# Altium schematic sheet pca20035_sheet4_sensors_and_leds.SchDoc: Thingy:91 Sensors and LEDs
size A3; Organization: Nordic Semiconductor; DocumentNumber: 4; SheetNumber: 4; SheetTotal: 6; CompanyName: Nordic Semiconductor; DocumentSize: A3
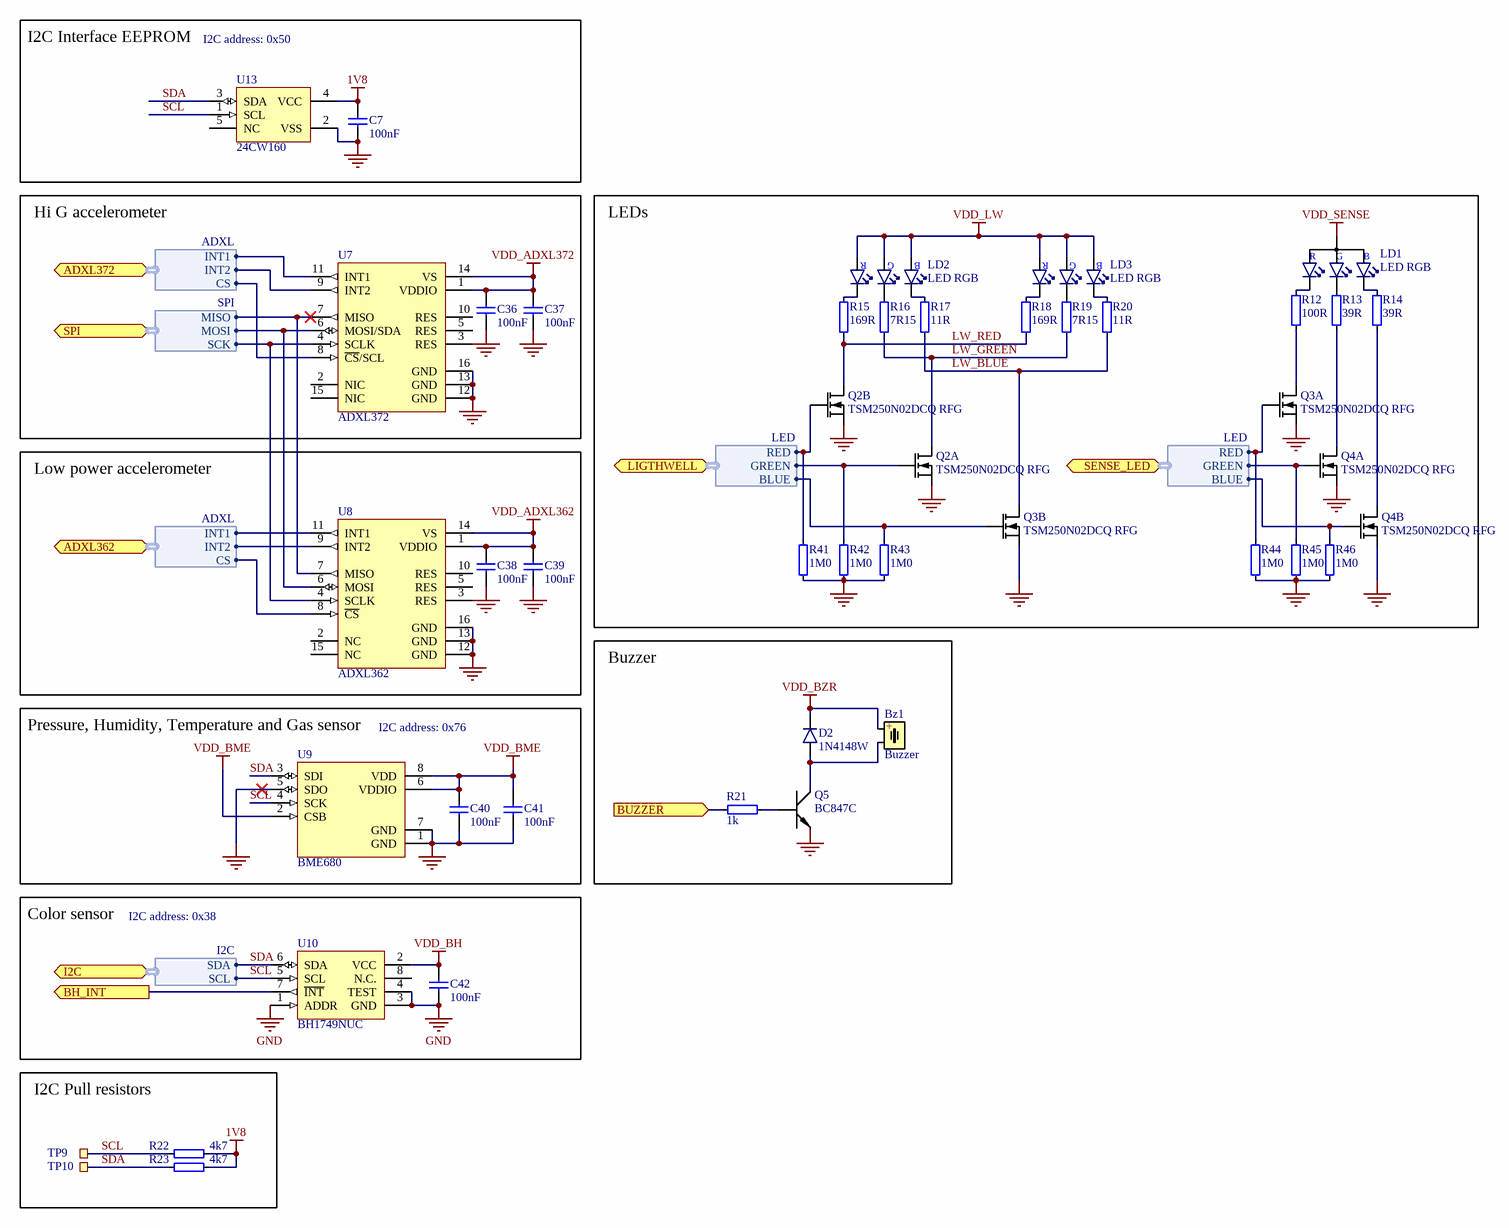
[diagram p0: pca20035_sheet4_sensors_and_leds.SchDoc]

## Parts
Bz1  Buzzer  [Buzzer_SMD_7.5x7.5]
C7  100nF  [CAPC0603X03L_C]
C36  100nF  [CAPC0603X03L_C]
C37  100nF  [CAPC0603X03L_C]
C38  100nF  [CAPC0603X03L_C]
C39  100nF  [CAPC0603X03L_C]
C40  100nF  [CAPC0603X03L_C]
C41  100nF  [CAPC0603X03L_C]
C42  100nF  [CAPC0603X03L_C]
D2  1N4148W  [SOD-123-DIODE]
LD1  LED RGB  [LED_RGB_0606]
LD2  LED RGB  [MSL0104]
LD3  LED RGB  [MSL0104]
Q2  TSM250N02DCQ RFG  [DFN65P200X200X80_HS-6N]  (parts A,B of 2)
Q3  TSM250N02DCQ RFG  [DFN65P200X200X80_HS-6N]  (parts A,B of 2)
Q4  TSM250N02DCQ RFG  [DFN65P200X200X80_HS-6N]  (parts A,B of 2)
Q5  BC847C  [SOT-23a]
R12  100R  [RESC0603X03L_C]
R13  39R  [RESC0603X03L_C]
R14  39R  [RESC0603X03L_C]
R15  169R  [RESC1005X04L]
R16  7R15  [RESC1005X04L]
R17  11R  [RESC1005X04L]
R18  169R  [RESC1005X04L]
R19  7R15  [RESC1005X04L]
R20  11R  [RESC1005X04L]
R21  1k  [RESC0603X03L_C]
R22  4k7  [RESC0603X03L_C]
R23  4k7  [RESC0603X03L_C]
R41  1M0  [RESC0603X03L_C]
R42  1M0  [RESC0603X03L_C]
R43  1M0  [RESC0603X03L_C]
R44  1M0  [RESC0603X03L_C]
R45  1M0  [RESC0603X03L_C]
R46  1M0  [RESC0603X03L_C]
TP9  Ø1.5mm,SMD  [TP_SMD_Ø1.5mm]  (value not drawn)  (no BOM)
TP10  Ø1.5mm,SMD  [TP_SMD_Ø1.5mm]  (value not drawn)  (no BOM)
U7  ADXL372  [LGA50P322X300X114-16N]
U8  ADXL362  [LGA50P322X300X114-16N]
U9  BME680  [BME680]
U10  BH1749NUC  [WSON50P210X210X60_HS-9N]
U13  24CW160  [SOT-23-5]

## Blocks framed on the sheet
I2C Interface EEPROM: C7 U13
Hi G accelerometer: C36 C37 U7
LEDs: LD1-LD3 Q2-Q4 R12-R20 R41-R46
Low power accelerometer: C38 C39 U8
Buzzer: Bz1 D2 Q5 R21
Pressure, Humidity, Temperature and Gas sensor: C40 C41 U9
Color sensor: C42 U10
I2C Pull resistors: R22 R23 TP9 TP10

## Ports
ADXL362 (bidir, harness ADXL), ADXL372 (bidir, harness ADXL), BH_INT (out), BUZZER (in), I2C (bidir, harness I2C), LIGTHWELL (bidir, harness LED), SENSE_LED (bidir, harness LED), SPI (bidir, harness SPI)

## Harnesses
I2C: SDA, SCL
LED: BLUE, GREEN, RED
SPI: MISO, MOSI, SCK
ADXL: CS, INT2, INT1

## Nets
1V8: C7.1 R22.1 R23.1 U13.4(VCC)
GND: C7.2 C36.1 C37.1 C38.1 C39.1 C40.1 C41.1 C42.1 Q2.1(S1) Q2.4(S2) Q3.1(S1) Q3.4(S2) Q4.1(S1) Q4.4(S2) Q5.2(E) R41.1 R42.1 R43.1 R44.1 R45.1 R46.1 U7.12(GND) U7.13(GND) U7.16(GND) U8.12(GND) U8.13(GND) U8.16(GND) U9.1(GND) U9.5(SDO) U9.7(GND) U10.1(ADDR) U10.3(GND) U10.4(TEST) U10.9(GND) U13.2(VSS)
VDD_ADXL362: C38.2 C39.2 U8.1(VDDIO) U8.14(VS)
VDD_ADXL372: C36.2 C37.2 U7.1(VDDIO) U7.14(VS)
VDD_BH: C42.2 U10.2(VCC)
VDD_BME: C40.2 C41.2 U9.2(CSB) U9.6(VDDIO) U9.8(VDD)
VDD_BZR: Bz1.1 D2.1(C)
VDD_LW: LD2.1(A_RED) LD2.2(A_GREEN) LD2.6(A_BLUE) LD3.1(A_RED) LD3.2(A_GREEN) LD3.6(A_BLUE)
VDD_SENSE: LD1.4(A)
BH_INT: U10.7(~{INT}) ; port BH_INT
BUZZER: R21.2 ; port BUZZER
LW_BLUE: Q3.3(D2) R17.1 R20.1
LW_GREEN: Q2.6(D1) R16.1 R19.1
LW_RED: Q2.3(D2) R15.1 R18.1
SCL: R22.2 TP9.1 U9.4(SCK) U10.5(SCL) U13.1(SCL) ; port I2C.SCL
SDA: R23.2 TP10.1 U9.3(SDI) U10.6(SDA) U13.3(SDA) ; port I2C.SDA
NetBz1_2: Bz1.2 D2.2(A) Q5.3(C)
NetLD1_1: LD1.1(C_RED) R12.2
NetLD1_2: LD1.2(C_GREEN) R13.2
NetLD1_3: LD1.3(C_BLUE) R14.2
NetLD2_3: LD2.3(C_GREEN) R16.2
NetLD2_4: LD2.4(C_RED) R15.2
NetLD2_5: LD2.5(C_BLUE) R17.2
NetLD3_3: LD3.3(C_GREEN) R19.2
NetLD3_4: LD3.4(C_RED) R18.2
NetLD3_5: LD3.5(C_BLUE) R20.2
NetQ2_2: Q2.2(G1) R42.2 ; port LIGTHWELL.GREEN
NetQ2_5: Q2.5(G2) R41.2 ; port LIGTHWELL.RED
NetQ3_2: Q3.2(G1) R44.2 ; port SENSE_LED.RED
NetQ3_5: Q3.5(G2) R43.2 ; port LIGTHWELL.BLUE
NetQ3_6: Q3.6(D1) R12.1
NetQ4_2: Q4.2(G1) R45.2 ; port SENSE_LED.GREEN
NetQ4_3: Q4.3(D2) R14.1
NetQ4_5: Q4.5(G2) R46.2 ; port SENSE_LED.BLUE
NetQ4_6: Q4.6(D1) R13.1
NetQ5_1: Q5.1(B) R21.1
NetU7_4: U7.4(SCLK) U8.4(SCLK) ; port SPI.SCK
NetU7_6: U7.6(MOSI/SDA) U8.6(MOSI) ; port SPI.MOSI
NetU7_7: U7.7(MISO) U8.7(MISO) ; port SPI.MISO
NetU7_8: U7.8(~{CS}/SCL) ; port ADXL372.CS
NetU7_9: U7.9(INT2) ; port ADXL372.INT2
NetU7_11: U7.11(INT1) ; port ADXL372.INT1
NetU8_8: U8.8(~{CS}) ; port ADXL362.CS
NetU8_9: U8.9(INT2) ; port ADXL362.INT2
NetU8_11: U8.11(INT1) ; port ADXL362.INT1

Not connected (* = marked no-connect by the designer): U7 2(NIC) 3(RES) 5(RES) 10(RES) 15(NIC); U8 2(NC) 3(RES) 5(RES) 10(RES) 15(NC); U10 8(N.C.); U13 5(NC)

## Notes on the sheet
- I2C address: 0x50
- (near U9) I2C address: 0x76
- I2C address: 0x38
- Size
- Date:
- A3
- Project Number
- Sheet         of
- Revision
- File:
- Drawn By:
- (in symbol AST7525MATRQ) +
- (in symbol LTST-C19HE1WT) R; G; B
- (in symbol MSL0104RGBU1) R; G; B

## Library data of the parts
Bz1 = AST7525MATRQ: Buzzer Transducer, 3.6V 100mA 2.7kHz 85dB @ 3.6V, SMD; Manufacturer: Mallory; Part number IPS: 00000001770; Note: N.A.; Pad Count: 2; Part Number: AST7525MATRQ; Manufacturer Part Number: AST7525MATRQ; ComponentLink1URL: N.A.; ComponentLink1Description: Datasheet; ComponentLink2URL: N.A.; ComponentLink2Description: Supplier link; HelpURL: https://www.mspindy.com/specifications/AST7525MATRQ.pdf; Footprint Doc: Buzzer_SMD_7.5x7.5; LatestRevisionDate: 2019-01-14; Published: 2019-01-14; Value: Buzzer; Supplier 1: Digi-Key; Supplier Part Number 1: 458-1100-1-ND; Supplier 2: Mouser; Supplier Part Number 2: 539-AST7525MATRQ; Artikkelnr Noca: N.A.; Component Class: Transducers; PartId: 101000024
C7 C36-C42 = C0201-100n: Capacitor, X5R, ±10%; Manufacturer: N.A.; Part number IPS: 00000001248, 00000002505; Note: 16V; Pad Count: 2; Part Number: C0201-100n; Manufacturer Part Number: N.A.; LatestRevisionDate: 2017-11-09; Published: 2014-11-13; Value: 100nF; Artikkelnr Noca: N.A.; Footprint Doc: 0201; ComponentLink1URL: N.A.; ComponentLink1Description: Datasheet; ComponentLink2URL: N.A.; ComponentLink2Description: Supplier link; HelpURL: N.A.; Supplier 1: N.A.; Supplier Part Number 1: N.A.; Supplier 2: N.A.; Supplier Part Number 2: N.A.; Component Class: Capacitors; PartId: 100200078
D2 = 1N4148W: 1N4148, Small Signal Fast Switching Diode; Manufacturer: Vishay; Manufacturer Part Number: 1N4148W-E3-08; Part number IPS: 00000001783; Artikkelnr Noca: N.A.; Pad Count: 2; Part Number: 1N4148W; ComponentLink1URL: N.A.; ComponentLink1Description: Datasheet; ComponentLink2URL: N.A.; ComponentLink2Description: Supplier link; HelpURL: http://www.vishay.com/docs/85748/1n4148w.pdf; Footprint Doc: SOD-123; LatestRevisionDate: 2016-01-12; Published: 2011-04-21; Value: 1N4148W; Note: Small Signal Fast Switching Diode; Supplier 1: Farnell; Supplier Part Number 1: 237-7282; Supplier 2: Digi-Key; Supplier Part Number 2: 1N4148W-E3-08CT-ND; Component Class: Semiconductors; PartId: 101300078
LD1 = LTST-C19HE1WT: RGB LED 1.60 mm x 1.60 mm SMD; Manufacturer: Lite-On Inc; Part number IPS: 00000007798; Note: N.A.; Pad Count: 4; Part Number: LTST-C19HE1WT; Manufacturer Part Number: LTST-C19HE1WT; LatestRevisionDate: 2016-09-23; Published: 2016-09-23; Value: LED RGB; Artikkelnr Noca: N.A.; Footprint Doc: LED_RGB_0606; ComponentLink1URL: N.A.; ComponentLink1Description: Datasheet; ComponentLink2URL: N.A.; ComponentLink2Description: Supplier link; HelpURL: http://optoelectronics.liteon.com/upload/download/DS22-2008-0044/S_110_LTST-C19HE1WT.pdf; Supplier 1: Digi-Key; Supplier Part Number 1: 160-2162-1-ND; Supplier 2: Mouser; Supplier Part Number 2: 859-LTST-C19HE1WT; Component Class: Optoelectronics; PartId: 101400093
LD2 LD3 = MSL0104RGBU1: High brightness, side view RGB LED; Manufacturer: Rohm Semiconductor; Part number IPS: 00000007799; Note: N.A.; Pad Count: 7; Part Number: MSL0104RGBU1; Manufacturer Part Number: MSL0104RGBU1; LatestRevisionDate: 2016-09-21; Published: 2016-09-21; Value: LED RGB; Artikkelnr Noca: N.A.; Footprint Doc: 6922; Supplier 1: Digi-Key; Supplier Part Number 1: MSL0104RGBU1CT-ND; Supplier 2: Mouser; Supplier Part Number 2: 755-MSL0104RGBU1; ComponentLink1URL: N.A.; ComponentLink1Description: Datasheet; ComponentLink2URL: N.A.; ComponentLink2Description: Supplier link; HelpURL: http://www.rohm.com/web/eu/datasheet/MSL0104RGBU; Component Class: Optoelectronics; PartId: 101400028
Q2-Q4 = TSM250N02DCQ RFG: Dual N Ch MOFET, 5.8A, 55mOhm max, 620mW; Manufacturer: Taiwan Semiconductor; Part number IPS: 00000001703; Note: N.A.; Pad Count: 6; Part Number: TSM250N02DCQ RFG; Manufacturer Part Number: TSM250N02DCQ RFG; Footprint Doc: VDFN-6; LatestRevisionDate: 2018-10-31; Published: 2018-10-31; Value: TSM250N02DCQ RFG; Artikkelnr Noca: N.A.; Supplier 1: Digi-Key; Supplier Part Number 1: TSM250N02DCQRFGCT-ND; Supplier 2: N.A.; Supplier Part Number 2: N.A.; ComponentLink1URL: https://www.taiwansemi.com/products/datasheet/TSM250N02D_B15.pdf; ComponentLink1Description: Datasheet; ComponentLink2URL: N.A.; ComponentLink2Description: Supplier link; HelpURL: https://www.taiwansemi.com/products/datasheet/TSM250N02D_B15.pdf; Component Class: Semiconductors; PartId: 101300161
Q5 = BC847C: BC847C, NPN Silicon transistor; Manufacturer: NXP Semiconductors; Part number IPS: 00000001793; Note: NPN Epitaxial Silicon Transistor; Artikkelnr Noca: 35019020; Pad Count: 3; Part Number: BC847C; Manufacturer Part Number: BC847C; ComponentLink1URL: N.A.; ComponentLink1Description: Datasheet; ComponentLink2URL: N.A.; ComponentLink2Description: Supplier link; HelpURL: N.A.; Footprint Doc: SOT-23a; LatestRevisionDate: 2009-11-23; Published: 2009-05-10; Value: BC847C; Supplier 1: Farnell; Supplier Part Number 1: 108-1235; Supplier 2: Digi-Key; Supplier Part Number 2: 568-1636-1-ND; Component Class: Semiconductors; PartId: 101300006
R12 = R0201-100: Resistor, ±1%, 0.05W; Manufacturer: N.A.; Part number IPS: 00000001794; Note: Chip Res 1%; Pad Count: 2; Part Number: R0201-100; Manufacturer Part Number: N.A.; LatestRevisionDate: 2014-11-13; Published: 2014-11-13; Value: 100R; Artikkelnr Noca: N.A.; Footprint Doc: 0201; ComponentLink1URL: N.A.; ComponentLink1Description: Datasheet; ComponentLink2URL: N.A.; ComponentLink2Description: Supplier link; HelpURL: N.A.; Supplier 1: N.A.; Supplier Part Number 1: N.A.; Supplier 2: N.A.; Supplier Part Number 2: N.A.; Component Class: Resistors; PartId: 100100027
R13 R14 = R0201-39R: Resistor, ±1%, 0.05W; Manufacturer: N.A.; Part number IPS: 00000001704; Note: Chip Res 1%; Pad Count: 2; Part Number: R0201-39R; Manufacturer Part Number: N.A.; LatestRevisionDate: 2014-11-13; Published: 2014-11-13; Value: 39R; Artikkelnr Noca: N.A.; Footprint Doc: 0201; ComponentLink1URL: N.A.; ComponentLink1Description: Datasheet; ComponentLink2URL: N.A.; ComponentLink2Description: Supplier link; HelpURL: N.A.; Supplier 1: N.A.; Supplier Part Number 1: N.A.; Supplier 2: N.A.; Supplier Part Number 2: N.A.; Component Class: Resistors; PartId: 100100021
R15 R18 = R0402-169: Resistor, ±1%, 0.063W; Manufacturer: N.A.; Part number IPS: 00000007805; Note: Chip Res 1%; Pad Count: 2; Part Number: R0402-169; Manufacturer Part Number: N.A.; LatestRevisionDate: 2016-09-22; Published: 2016-09-22; Value: 169R; Artikkelnr Noca: N.A.; Footprint Doc: 0402; ComponentLink1URL: N.A.; ComponentLink1Description: Datasheet; ComponentLink2URL: N.A.; ComponentLink2Description: Supplier link; HelpURL: N.A.; Supplier 1: Digi-Key; Supplier Part Number 1: 541-169LCT-ND; Supplier 2: N.A.; Supplier Part Number 2: N.A.; Component Class: Resistors; PartId: 100100153
R16 R19 = R0402-7R15: Resistor, ±1%, 0.063W; Manufacturer: N.A.; Part number IPS: 00000007806; Note: Chip Res 1%; Pad Count: 2; Part Number: R0402-7R15; Manufacturer Part Number: N.A.; LatestRevisionDate: 2016-09-22; Published: 2016-09-22; Value: 7R15; Artikkelnr Noca: N.A.; Footprint Doc: 0402; ComponentLink1URL: N.A.; ComponentLink1Description: Datasheet; ComponentLink2URL: N.A.; ComponentLink2Description: Supplier link; HelpURL: N.A.; Supplier 1: Digi-Key; Supplier Part Number 1: 541-7.15LLCT-ND; Supplier 2: N.A.; Supplier Part Number 2: N.A.; Component Class: Resistors; PartId: 100100123
R17 R20 = R0402-11R: Resistor, ±1%, 0.063W; Manufacturer: N.A.; Part number IPS: 00000007807; Note: Chip Res 1%; Pad Count: 2; Part Number: R0402-11R; Manufacturer Part Number: N.A.; LatestRevisionDate: 2016-11-09; Published: 2016-11-09; Value: 11R; Artikkelnr Noca: N.A.; Footprint Doc: 0402; ComponentLink1URL: N.A.; ComponentLink1Description: Datasheet; ComponentLink2URL: N.A.; ComponentLink2Description: Supplier link; HelpURL: N.A.; Supplier 1: Farnell; Supplier Part Number 1: 214-0577; Supplier 2: N.A.; Supplier Part Number 2: N.A.; Component Class: Resistors; PartId: 100100127
R21 = R0201-1k0: Resistor, ±1%, 0.05W; Manufacturer: N.A.; Part number IPS: 00000005786; Note: Chip Res 1%; Pad Count: 2; Part Number: R0201-1k0; Manufacturer Part Number: N.A.; ComponentLink1URL: N.A.; ComponentLink1Description: Datasheet; ComponentLink2URL: N.A.; ComponentLink2Description: Supplier link; HelpURL: N.A.; Footprint Doc: 0201; LatestRevisionDate: 2014-11-13; Published: 2014-11-13; Value: 1k; Supplier 1: N.A.; Supplier Part Number 1: N.A.; Supplier 2: N.A.; Supplier Part Number 2: N.A.; Artikkelnr Noca: N.A.; Component Class: Resistors; PartId: 100100043
R22 R23 = R0201-4k7: Resistor, ±1%, 0.05W; Manufacturer: N.A.; Part number IPS: 00000001706; Note: Chip Res 1%; Pad Count: 2; Part Number: R0201-4k7; Manufacturer Part Number: N.A.; Footprint Doc: 0201; LatestRevisionDate: 2014-11-13; Published: 2014-11-13; Value: 4k7; Artikkelnr Noca: N.A.; ComponentLink1URL: N.A.; ComponentLink1Description: Datasheet; ComponentLink2URL: N.A.; ComponentLink2Description: Supplier link; HelpURL: N.A.; Supplier 1: N.A.; Supplier Part Number 1: N.A.; Supplier 2: N.A.; Supplier Part Number 2: N.A.; Component Class: Resistors; PartId: 100100061
R41-R46 = R0201-1M0: Resistor, ±1%, 0.05W; Manufacturer: N.A.; Part number IPS: 00000001418; Note: Chip Res 1%; Pad Count: 2; Part Number: R0201-1M0; Manufacturer Part Number: N.A.; LatestRevisionDate: 2014-11-13; Published: 2014-11-13; Value: 1M0; Artikkelnr Noca: N.A.; Footprint Doc: 0201; ComponentLink1URL: N.A.; ComponentLink1Description: Datasheet; ComponentLink2URL: N.A.; ComponentLink2Description: Supplier link; HelpURL: N.A.; Supplier 1: N.A.; Supplier Part Number 1: N.A.; Supplier 2: N.A.; Supplier Part Number 2: N.A.; Component Class: Resistors; PartId: 100100093
TP9 TP10 = TP_SMD_Ø1.5MM: 1.5mm circular SMD testpad; Manufacturer: Nordic Semiconductor; Manufacturer Part Number: N.A.; Pad Count: 1; Part Number: TP_SMD_Ø1.5MM; Footprint Doc: TP_SMD_Ø1.5mm; LatestRevisionDate: 2016-06-02; Published: 2016-06-02; Value: Ø1.5mm,SMD; Note: N.A.; Artikkelnr Noca: N.A.; Part number IPS: N.A.; ComponentLink1URL: N.A.; ComponentLink1Description: Datasheet; ComponentLink2URL: N.A.; ComponentLink2Description: Supplier link; HelpURL: N.A.; Supplier 1: N.A.; Supplier Part Number 1: N.A.; Supplier 2: N.A.; Supplier Part Number 2: N.A.; Component Class: Connectors; PartId: 100500477
U7 = ADXL372: Micropower, 3-Axis, ±200g digital output acelerometer; Manufacturer: Analog Devices; Part number IPS: 00000001798; Note: N.A.; Pad Count: 16; Part Number: ADXL372; Manufacturer Part Number: ADXL372; Footprint Doc: LGA-16; LatestRevisionDate: 2018-08-24; Published: 2018-08-24; Value: ADXL372; Artikkelnr Noca: N.A.; ComponentLink1URL: http://www.analog.com/media/en/technical-documentation/data-sheets/ADXL372.pdf; ComponentLink1Description: Datasheet; ComponentLink2URL: http://www.analog.com/en/products/adxl372.html; ComponentLink2Description: Supplier link; HelpURL: http://www.analog.com/en/products/adxl372.html; Supplier 1: Digi-Key; Supplier Part Number 1: ADXL372BCCZ-RL7CT-ND; Supplier 2: N.A.; Supplier Part Number 2: N.A.; Component Class: Misc_ICs; PartId: 101900553
U8 = ADXL362: Micropower, 3-Axis, ±2 g/±4 g/±8 g Digital Output MEMS Accelerometer; Manufacturer: Analog Devices; Part number IPS: 00000001799; Note: N.A.; Pad Count: 16; Part Number: ADXL362; Manufacturer Part Number: ADXL362; ComponentLink1URL: http://www.analog.com/media/en/technical-documentation/data-sheets/ADXL362.pdf; ComponentLink1Description: Datasheet; ComponentLink2URL: http://www.analog.com/en/products/adxl362.html; ComponentLink2Description: Supplier link; HelpURL: https://www.analog.com/media/en/technical-documentation/data-sheets/ADXL362.pdf; Footprint Doc: LGA-16; LatestRevisionDate: 2019-01-11; Published: 2019-01-11; Value: ADXL362; Supplier 1: Digi-Key; Supplier Part Number 1: ADXL362BCCZ-RL7CT-ND; Supplier 2: Mouser; Supplier Part Number 2: 584-ADXL362BCCZ-R7; Artikkelnr Noca: N.A.; Component Class: Misc_ICs; PartId: 101900573
U9 = BME680: Low power gas, pressure, temperature & humidity sensor; Manufacturer: Bosch; Part number IPS: 00000001800; Note: N.A.; Pad Count: 8; Part Number: BME680; Manufacturer Part Number: BME680; Footprint Doc: LGA-8; LatestRevisionDate: 2018-05-24; Published: 2018-05-24; Value: BME680; Artikkelnr Noca: N.A.; ComponentLink1URL: https://ae-bst.resource.bosch.com/media/_tech/media/datasheets/BST-BME680-DS001-00.pdf; ComponentLink1Description: Datasheet; ComponentLink2Description: Supplier link; HelpURL: N.A.; Supplier 1: Digi-Key; Supplier Part Number 1: 828-1077-1-ND; Supplier 2: N.A.; Supplier Part Number 2: N.A.; Component Class: Misc_ICs; PartId: 101900532; ComponentLink2URL: N.A.
U10 = BH1749NUC: Digital 16bit Serial Output Type Color Sensor IC; Manufacturer: Rohm Semiconductor; Part number IPS: 00000001801; Note: N.A.; Pad Count: 8; Part Number: BH1749NUC; Manufacturer Part Number: BH1749NUC; Footprint Doc: WSON-8; LatestRevisionDate: 2019-01-11; Published: 2019-01-11; Value: BH1749NUC; Artikkelnr Noca: N.A.; ComponentLink1URL: N.A.; ComponentLink1Description: Datasheet; ComponentLink2URL: N.A.; ComponentLink2Description: Supplier link; HelpURL: https://www.rohm.com/datasheet/BH1749NUC/bh1749nuc-e; Supplier 1: Digi-Key; Supplier Part Number 1: BH1749NUC-E2CT-ND; Supplier 2: Mouser; Supplier Part Number 2: 755-BH1749NUC-E2; Component Class: Misc_ICs; PartId: 101900572
U13 = 24CW160T-I/OT: 16 Kbit I2C Serial EEPROM with Software Write Protection, 1.6-5.5 V Supply; Manufacturer: Microchip Technology; Part number IPS: 00000004049; Note: N.A.; Pad Count: 5; Part Number: 24CW160T-I/OT; Manufacturer Part Number: 24CW160T-I/OT; Footprint Doc: TSOT23-5; LatestRevisionDate: 2020-01-17; Published: 2020-01-17; Value: 24CW160; Artikkelnr Noca: N.A.; ComponentLink1URL: http://ww1.microchip.com/downloads/en/DeviceDoc/24CW16X-24CW32X-24CW64X-24CW128X-Data-Sheet-20005772B.pdf; ComponentLink1Description: Datasheet; ComponentLink2URL: https://www.digikey.com/product-detail/en/microchip-technology/24CW160T-I-OT/24CW160T-I-OTCT-ND/8594982; ComponentLink2Description: Supplier link; HelpURL: https://www.microchip.com/wwwproducts/en/24CW160; Supplier 1: Digi-Key; Supplier Part Number 1: 24CW160T-I/OTCT-ND; Supplier 2: Mouser; Supplier Part Number 2: 579-24CW160T-I/OT; Component Class: Misc_ICs; PartId: 101900604